# EAGLE design CS4354_breakout (EAGLE 7.7.0)
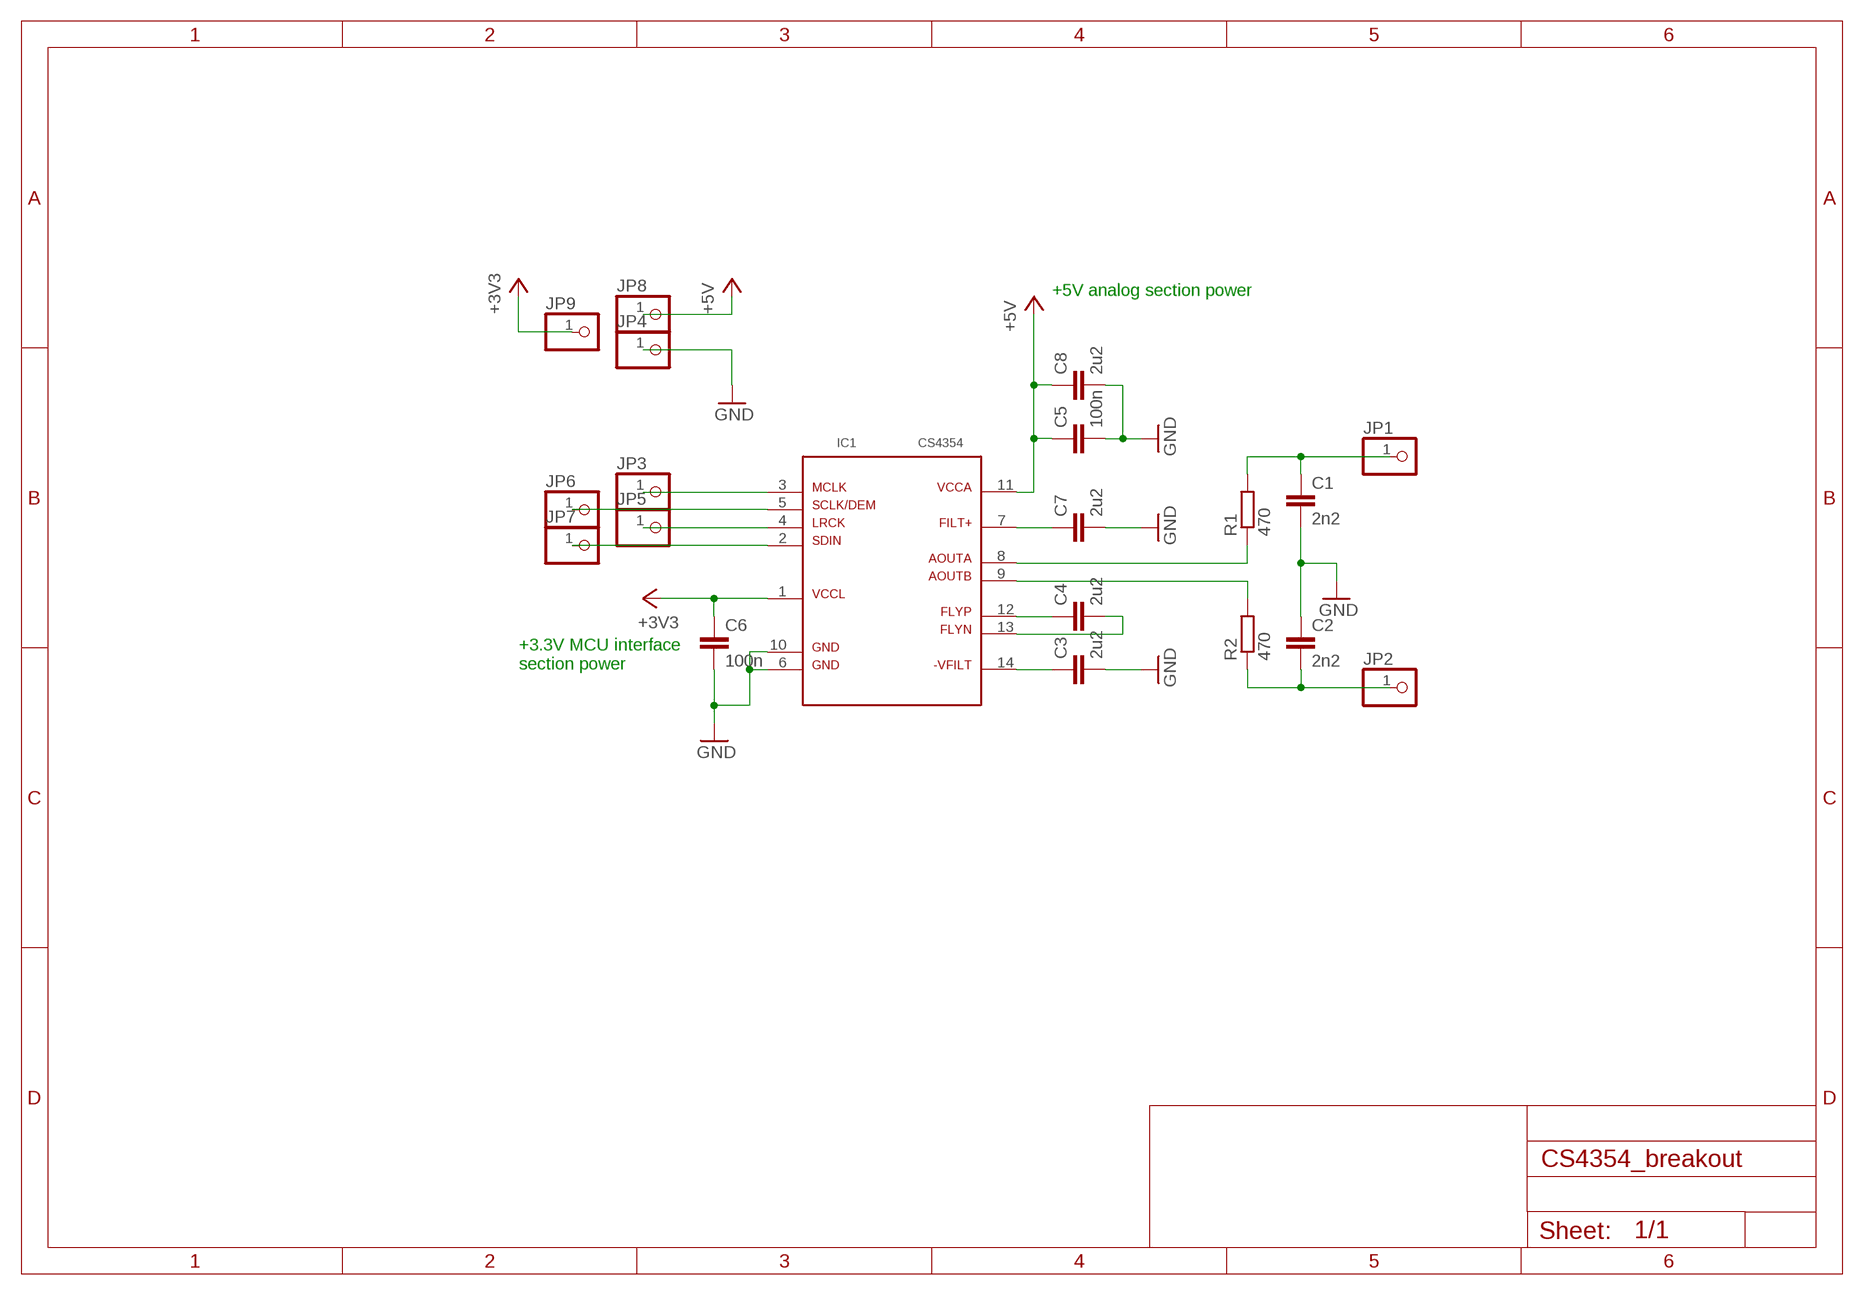
[diagram p0: schematic, sheet 1]

## Parts
C1  2n2  C-EUC0603K  [C0603K]
C2  2n2  C-EUC0603K  [C0603K]
C3  2u2  C-EUC0603K  [C0603K]
C4  2u2  C-EUC0603K  [C0603K]
C5  100n  C-EUC0603K  [C0603K]
C6  100n  C-EUC0603K  [C0603K]
C7  2u2  C-EUC0603K  [C0603K]
C8  2u2  C-EUC0603K  [C0603K]
IC1  CS4354  [SO14]
JP1  PINHD-1X1  [1X01]
JP2  PINHD-1X1  [1X01]
JP3  PINHD-1X1  [1X01]
JP4  PINHD-1X1  [1X01]
JP5  PINHD-1X1  [1X01]
JP6  PINHD-1X1  [1X01]
JP7  PINHD-1X1  [1X01]
JP8  PINHD-1X1  [1X01]
JP9  PINHD-1X1  [1X01]
R1  470  R-EU_R0603  [R0603]
R2  470  R-EU_R0603  [R0603]

## Nets
+3V3: C6.1 IC1.1 JP9.1
+5V: C5.1 C8.1 IC1.11 JP8.1
A_OUT: C1.1 JP1.1 R1.2
AOUTA: IC1.8 R1.1
AOUTB: IC1.9 R2.2
B_OUT: C2.2 JP2.1 R2.1
GND: C1.2 C2.1 C3.2 C5.2 C6.2 C7.2 C8.2 IC1.6 IC1.10 JP4.1
LRCK: IC1.4 JP5.1
MCLK: IC1.3 JP3.1
N$2: C7.1 IC1.7
N$3: C4.1 IC1.12
N$4: C4.2 IC1.13
N$5: C3.1 IC1.14
SCLK: IC1.5 JP6.1
SDIN: IC1.2 JP7.1

## Notes on the sheet
- +5V analog section power
- +3.3V MCU interface
  section power

## Library data of the parts
C1-C8 = rcl:C-EU: CAPACITOR, European symbol
IC1 = L71_devices:CS4354: CS4354 Audio I2S DAC
JP1-JP9 = pinhead:PINHD-1X1: PIN HEADER
R1 R2 = rcl:R-EU_: RESISTOR, European symbol

## Board
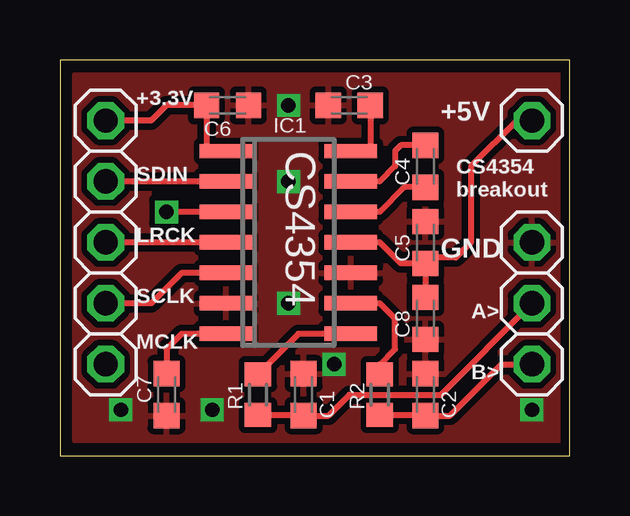
[diagram p1: board, top side]
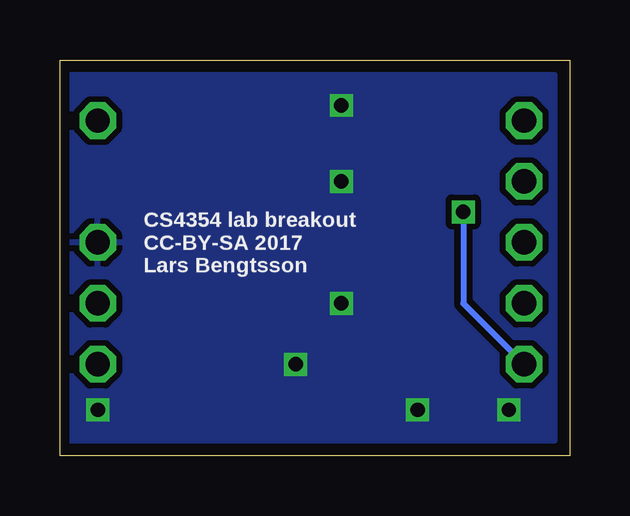
[diagram p2: board, bottom side, seen from below]

Size 21.26 x 16.5 mm. Coordinates in mm from the lower left corner, seen from the top.
Outline: 0,0 21.26,0 21.26,16.5 0,16.5 0,0
Copper layers (1*16): Top 0.0356mm / dielectric 1.5011mm / Bottom 0.0356mm
Design rules "Laen OSH Park PCBOrder": minimum track width 6mil, minimum drill 13mil, track to track 6mil, track to pad 6mil, pad to pad 6mil, via to via 6mil, smd to smd 6mil, copper to edge 15mil, drill to drill 6mil, minimum pad ring 7mil, minimum via ring 7mil, stop-mask expansion 3mil, vias tented up to drill 0mil, thermal gap 10mil

### Footprints (pad centres in the part's own frame; a part is rotated, then mirrored left to right if it is on the bottom)
C0603K = smd 1.05 x 1.08: 1 -0.875,0; 2 0.875,0
SO14 = smd 0.6 x 2.2: 1 -3.81,-2.6; 2 -2.54,-2.6; 3 -1.27,-2.6; 4 0,-2.6; 5 1.27,-2.6; 6 2.54,-2.6; 7 3.81,-2.6; 8 3.81,2.6; 9 2.54,2.6; 10 1.27,2.6; 11 0,2.6; 12 -1.27,2.6; 13 -2.54,2.6; 14 -3.81,2.6
1X01 = drill 1.016 octagon: 1 0,0
R0603 = smd 1 x 1.1: 1 -0.85,0; 2 0.85,0

### Placement (x,y rotation side)
C1  10.16,2.54 90 top
C2  15.24,2.54 270 top
C3  12.06,14.61 180 top
C4  15.24,12.06 90 top
C5  15.24,8.89 90 top
C6  6.99,14.61 0 top
C7  4.45,2.54 270 top
C8  15.24,5.71 270 top
IC1  9.53,8.89 270 top
JP1  19.68,6.35 0 top
JP2  19.68,3.81 0 top
JP3  1.91,3.81 0 top
JP4  19.68,8.89 0 top
JP5  1.91,8.89 0 top
JP6  1.91,6.35 0 top
JP7  1.91,11.43 0 top
JP8  19.68,13.97 0 top
JP9  1.91,13.97 0 top
R1  8.26,2.54 270 top
R2  13.34,2.54 90 top

### Tracks (layer width: path | path; a pad name or v marks a point on that pad's centre or on a via)
+3V3
  Top 0.254: IC1.1 6.35,12.7 6.11,12.94 C6.1 4.45,14.61 3.81,13.97 JP9.1
+5V
  Top 0.254: C5.1 14.21,8.02 13.34,8.89 IC1.11 | C5.1 15.24,8.26 | C5.1 C8.1 | C5.1 15.48,8.26 16.51,8.26 17.14,8.89 17.14,12.06 19.05,13.97 JP8.1
A_OUT
  Top 0.254: R1.2 10.13,1.69 C1.1 11.19,1.67 12.06,2.54 15.88,2.54 JP1.1
AOUTA
  Top 0.254: IC1.8 9.95,5.08 R1.1
AOUTB
  Top 0.254: R2.2 13.34,3.81 13.97,4.45 13.97,5.71 13.34,6.35 IC1.9
B_OUT
  Top 0.254: R2.1 15.21,1.69 C2.2 16.27,1.67 18.41,3.81 JP2.1
GND  (via drill 0.6)
  other vias: 9.53,14.61 9.53,6.35 9.53,11.43 11.43,3.81 6.35,1.91 2.54,1.91 19.68,1.91
  pour Top (isolate 0.254): 0.64,15.88 20.95,15.88 20.95,0.64 0.64,0.64
  pour Bottom (isolate 0.254): 0.64,15.88 20.95,15.88 20.95,0.64 0.64,0.64
LRCK
  Top 0.254: IC1.4 JP5.1
MCLK  (via drill 0.6)
  Top 0.254: IC1.3 v4.45,10.16
  Bottom 0.254: v4.45,10.16 4.45,6.35 JP3.1
N$2
  Top 0.254: IC1.7 5.08,5.08 4.45,4.45 C7.1
N$3
  Top 0.254: C4.1 14.37,11.19 13.34,10.16 IC1.12
N$4
  Top 0.254: C4.2 14.21,12.94 13.97,12.7 13.97,12.06 13.34,11.43 IC1.13
N$5
  Top 0.254: C3.1 12.94,12.94 12.7,12.7 IC1.14
SCLK
  Top 0.254: IC1.5 5.08,7.62 3.81,6.35 JP6.1
SDIN
  Top 0.254: IC1.2 JP7.1

### Text on the board
tNames: +3.3V | +5V | SDIN | CS4354 / breakout | LRCK | GND | SCLK | A> | MCLK | B>
bNames: CS4354 lab breakout / CC-BY-SA 2017 / Lars Bengtsson